# Altium schematic sheet voltage_sensor_HiZ_OpAmp.SchDoc
size A3
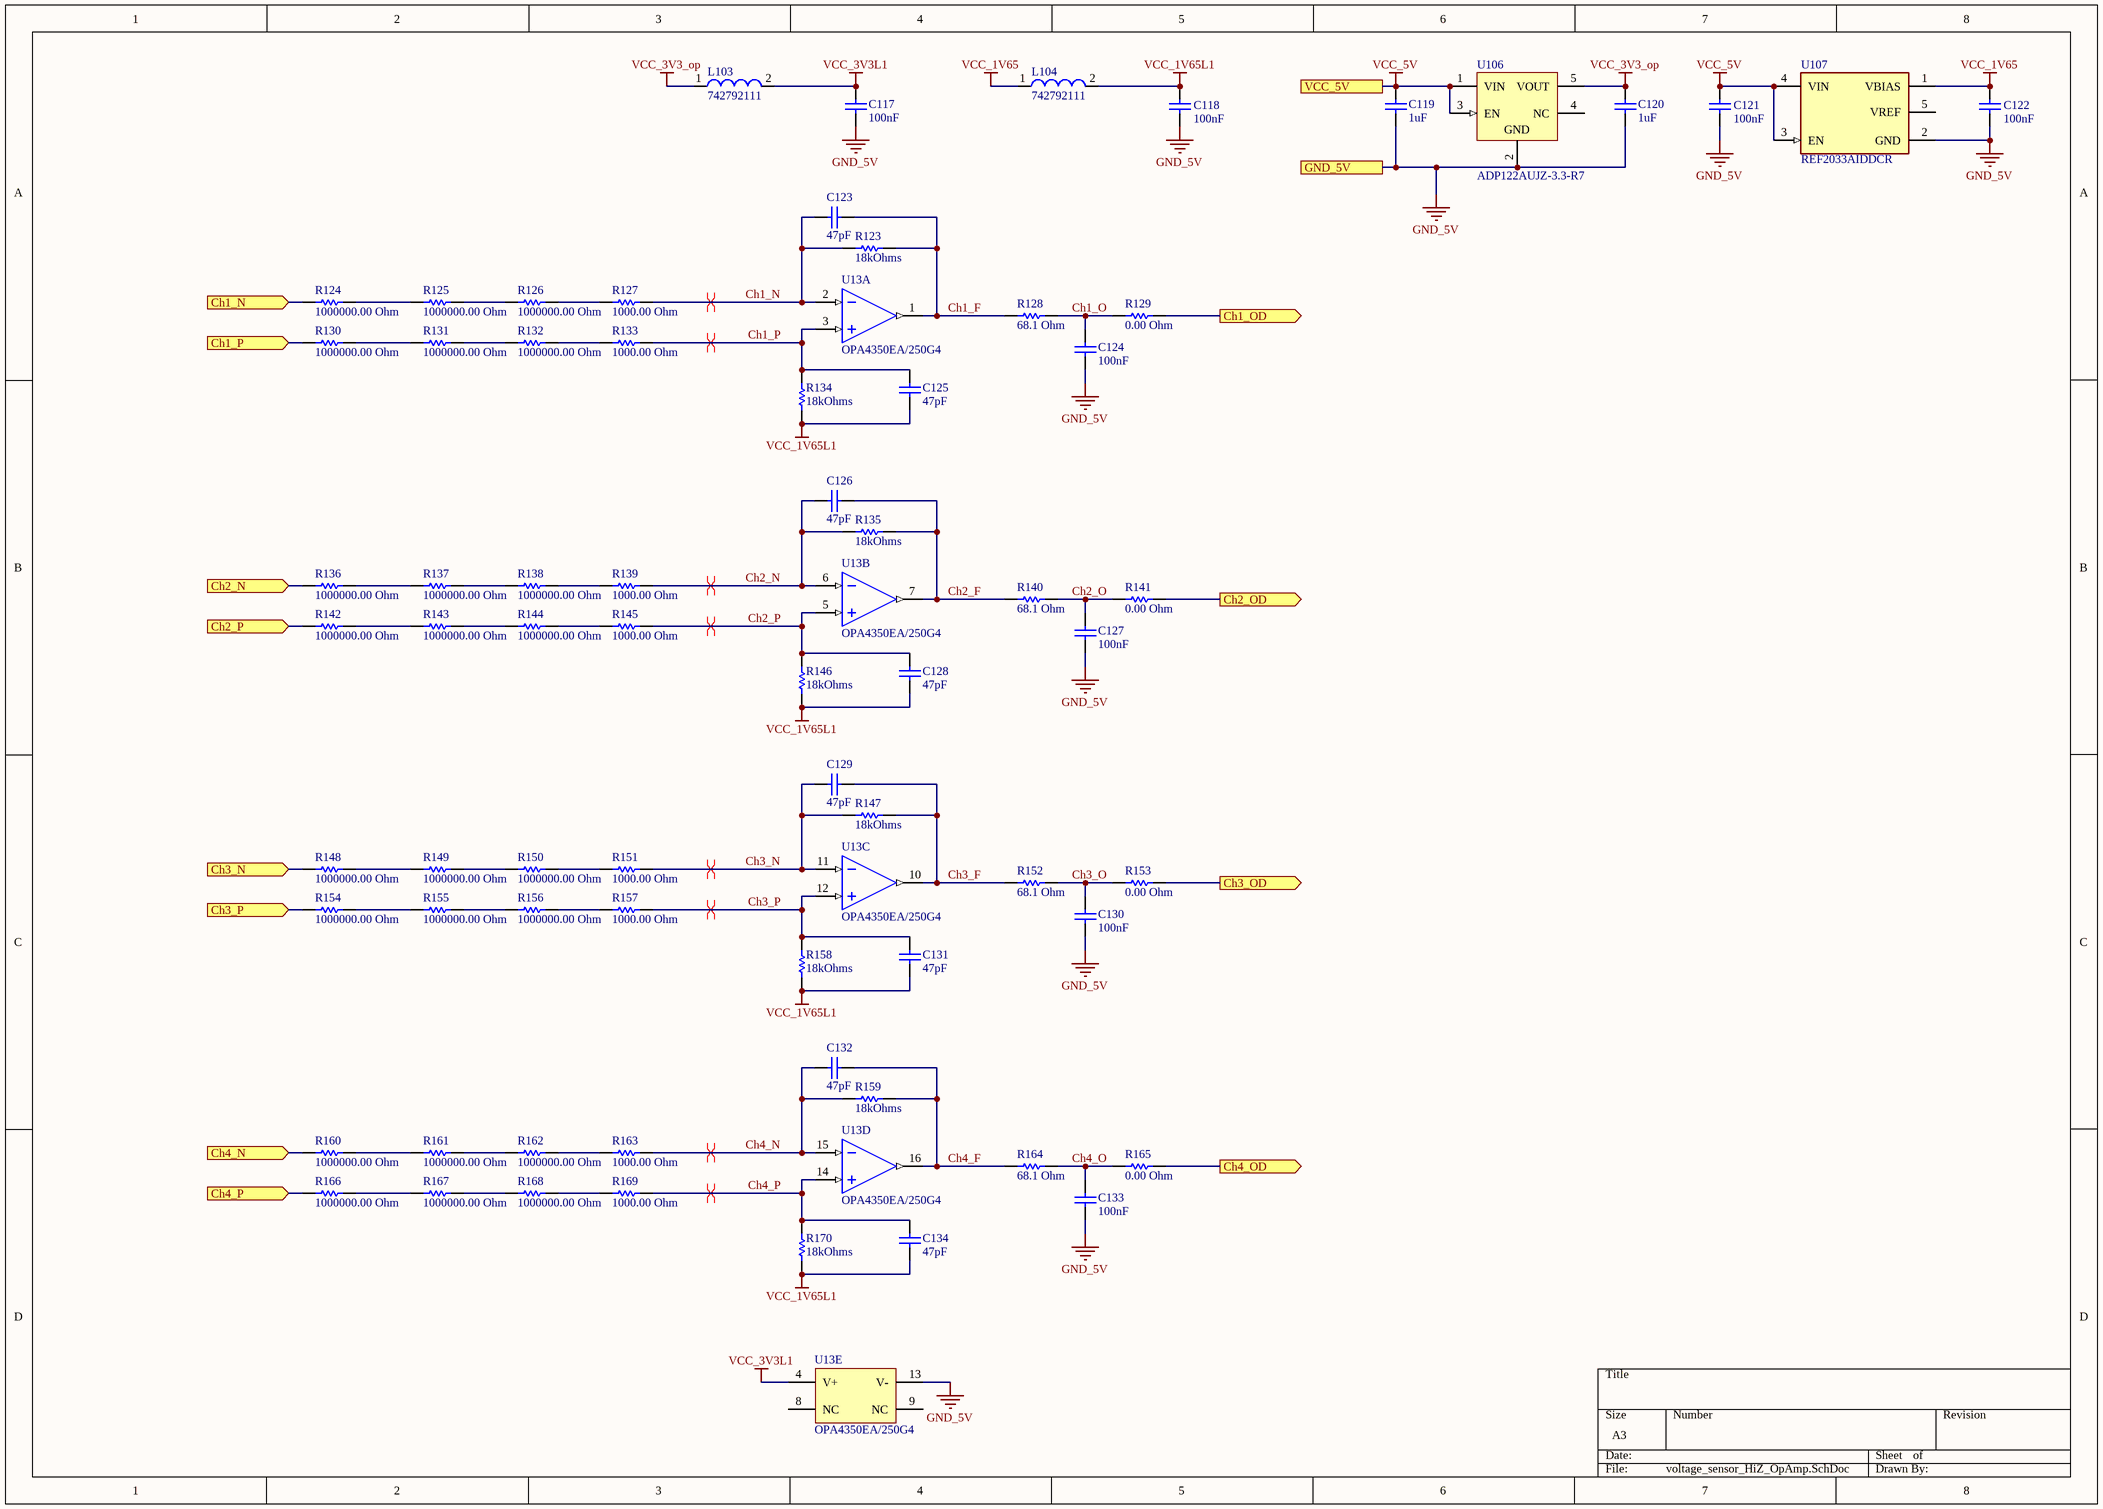
[diagram p0: voltage_sensor_HiZ_OpAmp.SchDoc]

## Parts
C117  value 100nF  [CAPC0603(1608)100_N]  (hidden comment: CAP 100nF 10V 0603(1608))
C118  value 100nF  [CAPC0603(1608)100_N]  (hidden comment: CAP 100nF 10V 0603(1608))
C119  value 1uF  [CAPC0603(1608)100_N]  (hidden comment: CAP 1uF 50V 0603(1608))
C120  value 1uF  [CAPC0603(1608)100_N]  (hidden comment: CAP 1uF 50V 0603(1608))
C121  value 100nF  [CAPC0603(1608)100_N]  (hidden comment: CAP 100nF 10V 0603(1608))
C122  value 100nF  [CAPC0603(1608)100_N]  (hidden comment: CAP 100nF 10V 0603(1608))
C123  value 47pF  [CAPC0603(1608)100_L]  (hidden comment: CAP 47pF 50V 0603(1608))
C124  value 100nF  [CAPC0603(1608)100_L]  (hidden comment: CAP 100nF 10V 0603(1608))
C125  value 47pF  [CAPC0603(1608)100_L]  (hidden comment: CAP 47pF 50V 0603(1608))
C126  value 47pF  [CAPC0603(1608)100_L]  (hidden comment: CAP 47pF 50V 0603(1608))
C127  value 100nF  [CAPC0603(1608)100_L]  (hidden comment: CAP 100nF 10V 0603(1608))
C128  value 47pF  [CAPC0603(1608)100_L]  (hidden comment: CAP 47pF 50V 0603(1608))
C129  value 47pF  [CAPC0603(1608)100_L]  (hidden comment: CAP 47pF 50V 0603(1608))
C130  value 100nF  [CAPC0603(1608)100_L]  (hidden comment: CAP 100nF 10V 0603(1608))
C131  value 47pF  [CAPC0603(1608)100_L]  (hidden comment: CAP 47pF 50V 0603(1608))
C132  value 47pF  [CAPC0603(1608)100_L]  (hidden comment: CAP 47pF 50V 0603(1608))
C133  value 100nF  [CAPC0603(1608)100_L]  (hidden comment: CAP 100nF 10V 0603(1608))
C134  value 47pF  [CAPC0603(1608)100_L]  (hidden comment: CAP 47pF 50V 0603(1608))
L103  742792111  [SMD-1206]
L104  742792111  [SMD-1206]
R123  Resistance: 18kOhms  [RESC1608X55X25NL10T15]  (hidden comment: RC0603FR-0718KL)
R124  value 1000000.00 Ohm  [RESC1206(3216)_L]  (hidden comment: 1M 1% 1206(3216))
R125  value 1000000.00 Ohm  [RESC1206(3216)_L]  (hidden comment: 1M 1% 1206(3216))
R126  value 1000000.00 Ohm  [RESC1206(3216)_L]  (hidden comment: 1M 1% 1206(3216))
R127  value 1000.00 Ohm  [RESC1206(3216)_L]  (hidden comment: 1K 1% 1206(3216))
R128  value 68.1 Ohm  [RESC1608X55X30LL15T15]  (hidden comment: ERJ-3EKF68R1V)
R129  value 0.00 Ohm  [RESC0603(1608)_L]  (hidden comment: Jumper 0603(1608))
R130  value 1000000.00 Ohm  [RESC1206(3216)_L]  (hidden comment: 1M 1% 1206(3216))
R131  value 1000000.00 Ohm  [RESC1206(3216)_L]  (hidden comment: 1M 1% 1206(3216))
R132  value 1000000.00 Ohm  [RESC1206(3216)_L]  (hidden comment: 1M 1% 1206(3216))
R133  value 1000.00 Ohm  [RESC1206(3216)_L]  (hidden comment: 1K 1% 1206(3216))
R134  Resistance: 18kOhms  [RESC1608X55X25NL10T15]  (hidden comment: RC0603FR-0718KL)
R135  Resistance: 18kOhms  [RESC1608X55X25NL10T15]  (hidden comment: RC0603FR-0718KL)
R136  value 1000000.00 Ohm  [RESC1206(3216)_L]  (hidden comment: 1M 1% 1206(3216))
R137  value 1000000.00 Ohm  [RESC1206(3216)_L]  (hidden comment: 1M 1% 1206(3216))
R138  value 1000000.00 Ohm  [RESC1206(3216)_L]  (hidden comment: 1M 1% 1206(3216))
R139  value 1000.00 Ohm  [RESC1206(3216)_L]  (hidden comment: 1K 1% 1206(3216))
R140  value 68.1 Ohm  [RESC1608X55X30LL15T15]  (hidden comment: ERJ-3EKF68R1V)
R141  value 0.00 Ohm  [RESC0603(1608)_L]  (hidden comment: Jumper 0603(1608))
R142  value 1000000.00 Ohm  [RESC1206(3216)_L]  (hidden comment: 1M 1% 1206(3216))
R143  value 1000000.00 Ohm  [RESC1206(3216)_L]  (hidden comment: 1M 1% 1206(3216))
R144  value 1000000.00 Ohm  [RESC1206(3216)_L]  (hidden comment: 1M 1% 1206(3216))
R145  value 1000.00 Ohm  [RESC1206(3216)_L]  (hidden comment: 1K 1% 1206(3216))
R146  Resistance: 18kOhms  [RESC1608X55X25NL10T15]  (hidden comment: RC0603FR-0718KL)
R147  Resistance: 18kOhms  [RESC1608X55X25NL10T15]  (hidden comment: RC0603FR-0718KL)
R148  value 1000000.00 Ohm  [RESC1206(3216)_L]  (hidden comment: 1M 1% 1206(3216))
R149  value 1000000.00 Ohm  [RESC1206(3216)_L]  (hidden comment: 1M 1% 1206(3216))
R150  value 1000000.00 Ohm  [RESC1206(3216)_L]  (hidden comment: 1M 1% 1206(3216))
R151  value 1000.00 Ohm  [RESC1206(3216)_L]  (hidden comment: 1K 1% 1206(3216))
R152  value 68.1 Ohm  [RESC1608X55X30LL15T15]  (hidden comment: ERJ-3EKF68R1V)
R153  value 0.00 Ohm  [RESC0603(1608)_L]  (hidden comment: Jumper 0603(1608))
R154  value 1000000.00 Ohm  [RESC1206(3216)_L]  (hidden comment: 1M 1% 1206(3216))
R155  value 1000000.00 Ohm  [RESC1206(3216)_L]  (hidden comment: 1M 1% 1206(3216))
R156  value 1000000.00 Ohm  [RESC1206(3216)_L]  (hidden comment: 1M 1% 1206(3216))
R157  value 1000.00 Ohm  [RESC1206(3216)_L]  (hidden comment: 1K 1% 1206(3216))
R158  Resistance: 18kOhms  [RESC1608X55X25NL10T15]  (hidden comment: RC0603FR-0718KL)
R159  Resistance: 18kOhms  [RESC1608X55X25NL10T15]  (hidden comment: RC0603FR-0718KL)
R160  value 1000000.00 Ohm  [RESC1206(3216)_L]  (hidden comment: 1M 1% 1206(3216))
R161  value 1000000.00 Ohm  [RESC1206(3216)_L]  (hidden comment: 1M 1% 1206(3216))
R162  value 1000000.00 Ohm  [RESC1206(3216)_L]  (hidden comment: 1M 1% 1206(3216))
R163  value 1000.00 Ohm  [RESC1206(3216)_L]  (hidden comment: 1K 1% 1206(3216))
R164  value 68.1 Ohm  [RESC1608X55X30LL15T15]  (hidden comment: ERJ-3EKF68R1V)
R165  value 0.00 Ohm  [RESC0603(1608)_L]  (hidden comment: Jumper 0603(1608))
R166  value 1000000.00 Ohm  [RESC1206(3216)_L]  (hidden comment: 1M 1% 1206(3216))
R167  value 1000000.00 Ohm  [RESC1206(3216)_L]  (hidden comment: 1M 1% 1206(3216))
R168  value 1000000.00 Ohm  [RESC1206(3216)_L]  (hidden comment: 1M 1% 1206(3216))
R169  value 1000.00 Ohm  [RESC1206(3216)_L]  (hidden comment: 1K 1% 1206(3216))
R170  Resistance: 18kOhms  [RESC1608X55X25NL10T15]  (hidden comment: RC0603FR-0718KL)
U13  OPA4350EA/250G4  [TI-DBQ16_L]  (parts A,B,C,D,E of 5)
U106  ADP122AUJZ-3.3-R7  [ADI-UJ-5_N]
U107  REF2033AIDDCR  [FP-DDC0005A-IPC_C]

## Ports
Ch1_N (in), Ch1_OD (out), Ch1_P (in), Ch2_N (in), Ch2_OD (out), Ch2_P (in), Ch3_N (in), Ch3_OD (out), Ch3_P (in), Ch4_N (in), Ch4_OD (out), Ch4_P (in), GND_5V, VCC_5V

## Nets
GND_5V: C117.1 C118.1 C119.1 C120.1 C121.1 C122.1 C124.1 C127.1 C130.1 C133.1 U13.13(V-) U106.2(GND) U107.2(GND) ; port GND_5V
VCC_1V65: C122.2 L104.1 U107.1(VBIAS)
VCC_1V65L1: C118.2 C125.2 C128.2 C131.2 C134.2 L104.2 R134.2 R146.2 R158.2 R170.2
VCC_3V3_op: C120.2 L103.1 U106.5(VOUT)
VCC_3V3L1: C117.2 L103.2 U13.4(V+)
VCC_5V: C119.2 C121.2 U106.1(VIN) U106.3(EN) U107.3(EN) U107.4(VIN) ; port VCC_5V
Ch1_F: C123.2 R123.1 R128.2 U13.1(OUT_A)
Ch1_N: C123.1 R123.2 R127.1 U13.2(IN_A-)
Ch1_N: R124.2 ; port Ch1_N  [a separate net that carries the same name]
Ch1_O: C124.2 R128.1 R129.2
Ch1_OD: R129.1 ; port Ch1_OD
Ch1_P: C125.1 R133.1 R134.1 U13.3(IN_A+)
Ch1_P: R130.2 ; port Ch1_P  [a separate net that carries the same name]
Ch2_F: C126.2 R135.1 R140.2 U13.7(OUT_B)
Ch2_N: C126.1 R135.2 R139.1 U13.6(IN_B-)
Ch2_N: R136.2 ; port Ch2_N  [a separate net that carries the same name]
Ch2_O: C127.2 R140.1 R141.2
Ch2_OD: R141.1 ; port Ch2_OD
Ch2_P: C128.1 R145.1 R146.1 U13.5(IN_B+)
Ch2_P: R142.2 ; port Ch2_P  [a separate net that carries the same name]
Ch3_F: C129.2 R147.1 R152.2 U13.10(OUT_C)
Ch3_N: C129.1 R147.2 R151.1 U13.11(IN_C-)
Ch3_N: R148.2 ; port Ch3_N  [a separate net that carries the same name]
Ch3_O: C130.2 R152.1 R153.2
Ch3_OD: R153.1 ; port Ch3_OD
Ch3_P: C131.1 R157.1 R158.1 U13.12(IN_C+)
Ch3_P: R154.2 ; port Ch3_P  [a separate net that carries the same name]
Ch4_F: C132.2 R159.1 R164.2 U13.16(OUT_D)
Ch4_N: C132.1 R159.2 R163.1 U13.15(IN_D-)
Ch4_N: R160.2 ; port Ch4_N  [a separate net that carries the same name]
Ch4_O: C133.2 R164.1 R165.2
Ch4_OD: R165.1 ; port Ch4_OD
Ch4_P: C134.1 R169.1 R170.1 U13.14(IN_D+)
Ch4_P: R166.2 ; port Ch4_P  [a separate net that carries the same name]
NetR124_1: R124.1 R125.2
NetR125_1: R125.1 R126.2
NetR126_1: R126.1 R127.2
NetR130_1: R130.1 R131.2
NetR131_1: R131.1 R132.2
NetR132_1: R132.1 R133.2
NetR136_1: R136.1 R137.2
NetR137_1: R137.1 R138.2
NetR138_1: R138.1 R139.2
NetR142_1: R142.1 R143.2
NetR143_1: R143.1 R144.2
NetR144_1: R144.1 R145.2
NetR148_1: R148.1 R149.2
NetR149_1: R149.1 R150.2
NetR150_1: R150.1 R151.2
NetR154_1: R154.1 R155.2
NetR155_1: R155.1 R156.2
NetR156_1: R156.1 R157.2
NetR160_1: R160.1 R161.2
NetR161_1: R161.1 R162.2
NetR162_1: R162.1 R163.2
NetR166_1: R166.1 R167.2
NetR167_1: R167.1 R168.2
NetR168_1: R168.1 R169.2

Not connected (* = marked no-connect by the designer): U13 8(NC) 9(NC); U106 4(NC); U107 5(VREF)

## Layout directives
differential pair: Ch1_N, Ch1_P, Ch2_N, Ch2_P, Ch3_N, Ch3_P, Ch4_N, Ch4_P

## Library data of the parts
C117 C118 C121 C122 C124 C127 C130 C133 = CMP-1035-02580-1: CAP 100nF 10V ±10% 0603 (1608 Metric) Thickness 1mm SMD; Tolerance: Â±10%; Case-EIA: 0603; Case-Metric: 1608; Max Thickness: 1 mm; Rated Voltage: 10 V; Technology: SMT
C119 C120 = CMP-1035-02746-1: CAP 1uF 50V ±20% 0603 (1608 Metric) Thickness 1mm SMD; Tolerance: Â±20%; Case-EIA: 0603; Case-Metric: 1608; Technology: SMT; Max Thickness: 1 mm; Rated Voltage: 50 V
C123 C125 C126 C128 C129 C131 C132 C134 = CMP-1035-01063-1: CAP 47pF 50V ±5% 0603 (1608 Metric) Thickness 1mm SMD; Case-EIA: 0603; Tolerance: Â±5%; Case-Metric: 1608; Technology: SMT; Max Thickness: 1 mm; Rated Voltage: 50 V
L103 L104 = CMP-0220-00024-1: SMD EMI Suppression Ferrite Bead WE-CBF, Z = 26 Ohm; Impedance: 26 Ohm; ComponentLink2Description: Datasheet; PackageReference: SMD-1206; ComponentLink2URL: http://www.we-online.de/katalog/media/pdf/742792111.pdf; PackageVersion: 2007; DatasheetVersion: Dec-2005; PackageDescription: Chip Inductor, 2-Leads, Body 3.2 x 1.6 mm; ComponentLink1URL: http://www.we-online.com; ComponentLink1Description: Manufacturer Link
R123 R134 R135 R146 R147 R158 R159 R170 = CMP-2000-06930-1: Chip Resistor, 18 KOhm, +/- 1%, 0.1 W, -55 to 155 degC, 0603 (1608 Metric), RoHS, Tape and Reel; Manufacturer: Yageo; Voltage Rating: 75V; Temperature Coefficient: 100PPM/C; Unit Weight: 0.000071oz; Power Rating: 100mW; Datasheet URL: http://www.yageo.com/documents/recent/PYu-RC_Group_51_RoHS_L_7.pdf; Packaging: Reel; Series: RC; Datasheet Version: Rev. 7, 05/2017; Type: GeneralPurposeChipResistorSurfaceMount; Termination Style: SMD/SMT; Package Reference: 0603; Operating Temperature Range: -55Cto+155C; Mounting Technology: SurfaceMount; Tolerance: 1%; Height: 0.45mm; Length: 1.6mm; Case Code - mm: 1608; Product: ThickFilmResistorsGeneralPurpose; RoHS: True; Product Category: ThickFilmResistors; Case Code - in: 0603; Brand: Yageo; Manufacturer URL: http://www.yageo.com/; Width: 0.8mm; Package / Case: 0603(1608metric); Package Description: 2-Pin Surface Mount Device, Body 1.6 x 0.8 mm
R124-R126 R130-R132 R136-R138 R142-R144 R148-R150 R154-R156 R160-R162 R166-R168 = CMP-1014-00849-1: 1M 0.25W 1% 1206 (3216 Metric)  SMD; Case-EIA: 1206; Case-Metric: 3216; Tolerance: 1 %; Power: 0.25 W; Technology: SMT
R127 R133 R139 R145 R151 R157 R163 R169 = CMP-1014-00510-1: 1K 0.25W 1% 1206 (3216 Metric)  SMD; Case-Metric: 3216; Case-EIA: 1206; Power: 0.25 W; Tolerance: 1 %; Technology: SMT
R128 R140 R152 R164 = CMP-2000-00621-1: Manufacturer: Panasonic; Tolerance: 1%; Part Number: ERJ-3EKF68R1V; Package: 0603
R129 R141 R153 R165 = CMP-1012-00001-1: Jumper 0603 (1608 Metric); Case-Metric: 1608; Power: None; Case-EIA: 0603; Technology: SMT; Tolerance: None
U13 = CMP-0272-00834-2: High-Speed, Single-Supply, Rail-to-Rail Operational Amplifier MicroAmplifier(TM) Series, 2.7 to 5.5 V, -55 to 150 degC, 16-pin SOP (DBQ16), Green (RoHS & no Sb/Br); Manufacturer: Texas Instruments; Iq per channel(Max)(mA): 7.5; Slew Rate(Typ)(V/us): 22; Sub Family: Low Input Bias Current Amp (<=10pA), Low Offset Voltage Amplifier (<=500uV), Low Supply Voltage Amplifier (<=2.7V), Precision Amplifier; Vn at 1kHz(Typ)(nV/rtHz): 18; CMRR(Min)(dB): 66; Offset Drift(Typ)(uV/C): 4; Vio (25C)(Max)(mV): 0.5; Total Supply Voltage(Min)(+5V is 5, +/-5V is 10): 2.7; IIB(Max)(pA): 10; Total Supply Voltage(Max)(+5V is 5, +/-5V is 10): 5.5; Eco-Plan: Green (RoHS & no Sb/Br); PackageVersion: 4073301-2/H, 10/2008; ComponentLink1Description: Manufacturer URL; ComponentLink2Description: Datasheet; Mounting Technology: Surface Mount; ComponentLink3Description: Package Specification; PackageReference: DBQ16; PartNumber: OPA4350EA/250G4; ComponentLink2URL: http://www.ti.com/general/docs/lit/getliterature.tsp?genericPartNumber=OPA4350&fileType=pdf; ComponentLink1URL: http://www.ti.com/; Code_JEDEC: MO-137; DatasheetVersion: SBOS099C; Number of Channels: 4; ComponentLink3URL: http://www.ti.com/litv/pdf/msoi004g; PackageDescription: 16-Pin, Plastic Small Outline, Body 3.9 x 4.9 mm, Pitch 0.635 mm
U106 = CMP-0786-00346-1: 300 mA, Low Quiescent Current, CMOS Linear Regulator, 2.3 to 5.5 V Vin, 3.3 V Vout, Industrial, 5-pin SOT23 (UJ-5), Reel; Manufacturer: Analog Devices; Vin (min) (V): 2.3; Supply Current IGND @ Small Load: 45uA; Vin (max) (V): 5.5; Iout max: 300mA; Preset Vout Values (V): 3.3; ComponentLink4Description: URL Link1; ComponentLink4URL: Product URL:http://www.analog.com/en/ADP122/productSearch.html; ComponentLink2URL: http://www.analog.com/static/imported-files/data_sheets/ADP122_123.pdf; PackageDescription: 5-Pin Thin Small Outline Transistor Package, Body 2.9 x 1.6 mm, Pitch 0.95 mm; ComponentLink1URL: http://www.analog.com/en/index.html; ComponentLink3URL: http:/www.analog.com/static/imported-files/packages/PKG_PDF/TSOT(UJ)/UJ_5.pdf; ComponentLink2Description: Datasheet; PartNumber: ADP122AUJZ-3.3-R7; Packing: Reel; ComponentLink1Description: Manufacturer URL; Code_JEDEC: MO-193-AB; PackageVersion: 100708-A, 10/2008; PackageReference: UJ-5; Mounting Technology: Surface Mount; DatasheetVersion: Rev. E; ComponentLink3Description: Package Specification
U107 = CMP-04916-000008-1: IC VREF SERIES 1.65V/3.3V 5SOT; Manufacturer: Texas Instruments; Standoff Height: 0mm; Nominal Supply Current: 360uA; Min Supply Voltage: 3.32V; Output Type: Fixed; Number Of Outputs: 2; Output Voltage: 1.65/3.3V; Output Current: 20mA; Max Supply Voltage: 5.5V; Max Junction Temp: +150°C; Automotive: No; Height: 1.1mm; Package: DDC0005A; Reference Type: Series; Manufacturer Part Number: REF2033AIDDCR; Temperature Range High: +125°C; Lead Free: Yes; ComponentLink2Description: Datasheet; Device Class L1: Integrated Circuits (ICs); Category: IC; RoHS: TRUE; Device Class L3: Voltage References; ComponentLink2URL: http://www.ti.com/lit/ds/symlink/ref2033.pdf; Device Class L2: Power Management ICs; Octopart: https://octopart.com/ref2033aiddcr-texas+instruments-46921199; Digikey Description: IC VREF SERIES 1.65V/3.3V 5SOT; Temperature: -40°C to +125°C; Temperature Range Low: -40°C